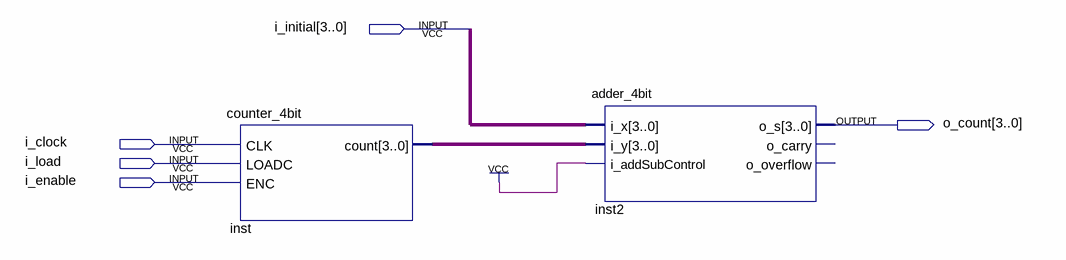
[diagram p0: schematic sheet]
// Quartus schematic DCounterFromValue_4bit.bdf as structural Verilog: 2 symbols, 5 pins
module DCounterFromValue_4bit (
  input  [3:0] i_initial,
  input  i_clock,
  input  i_load,
  input  i_enable,
  output [3:0] o_count
);

  wire [3:0] inst_count;

  counter_4bit inst (.CLK(i_clock), .LOADC(i_load), .ENC(i_enable), .count(inst_count));
  adder_4bit inst2 (
    .i_x(i_initial), .i_y(inst_count), .i_addSubControl(1'b1), .o_s(o_count));  // open: o_carry, o_overflow
endmodule
